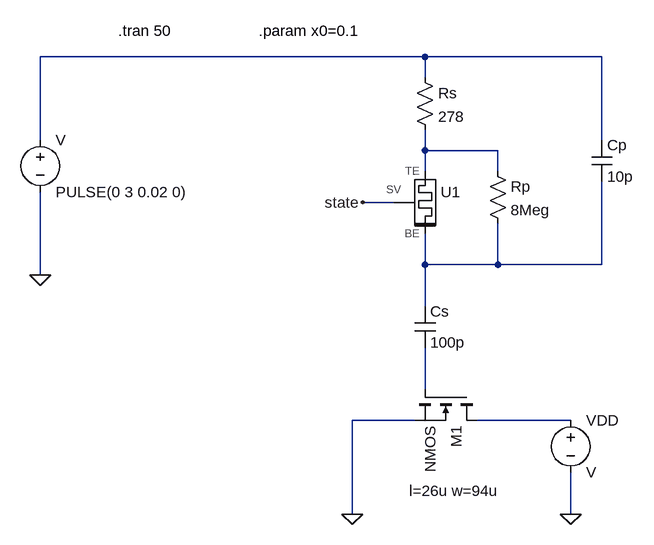
[diagram p0: schematic task9.asc]
task9.asc, the LTspice schematic file:
Version 4
SHEET 1 1352 680
WIRE 384 -160 -208 -160
WIRE 656 -160 384 -160
WIRE 384 -128 384 -160
WIRE -208 -32 -208 -160
WIRE 656 -32 656 -160
WIRE 384 -16 384 -48
WIRE 496 -16 384 -16
WIRE 384 16 384 -16
WIRE 496 16 496 -16
WIRE 336 64 288 64
WIRE 384 160 384 112
WIRE 496 160 496 96
WIRE 496 160 384 160
WIRE 656 160 656 32
WIRE 656 160 496 160
WIRE -208 176 -208 48
WIRE 384 224 384 160
WIRE 384 352 384 288
WIRE 368 400 272 400
WIRE 608 400 464 400
WIRE 272 544 272 400
WIRE 608 544 608 480
FLAG 288 64 state
FLAG -208 176 0
FLAG 608 544 0
FLAG 272 544 0
SYMBOL res 368 -144 R0
SYMATTR InstName Rs
SYMATTR Value 278
SYMBOL res 480 0 R0
SYMATTR InstName Rp
SYMATTR Value 8Meg
SYMBOL voltage -208 -48 R0
WINDOW 123 0 0 Left 0
WINDOW 39 0 0 Left 0
SYMATTR InstName V
SYMATTR Value PULSE(0 3 0.02 0)
SYMBOL Memristor 368 16 R0
SYMATTR InstName U1
SYMBOL cap 640 -32 R0
SYMATTR InstName Cp
SYMATTR Value 10p
SYMBOL cap 368 224 R0
SYMATTR InstName Cs
SYMATTR Value 100p
SYMBOL nmos 464 352 R90
WINDOW 123 156 -34 VRight 2
SYMATTR InstName M1
SYMATTR Value2 l=26u w=94u
SYMBOL voltage 608 384 R0
SYMATTR InstName VDD
TEXT -88 -200 Left 2 !.tran 50
TEXT 128 -200 Left 2 !.param x0=0.1

The netlist it stands for:
* task9.asc
Rs N001 N002 278
Rp N002 N003 8Meg
V N001 0 PULSE(0 3 0.02 0)
XU1 N002 N003 state MEM_NAMLAB_CORE  ; pins TE BE SV
Cp N001 N003 10p
Cs N003 N004 100p
M1 N005 N004 0 0 NMOS l=26u w=94u
VDD N005 0 V
.model NMOS NMOS
.model PMOS PMOS
.lib standard.mos
.tran 50
.param x0=0.1
.lib MEM_NAMLAB_CORE.sub
.backanno
.end